# Altium schematic sheet ESP32.SchDoc
size 420 x 297 mm; SheetNumber: 3; SheetTotal: 6
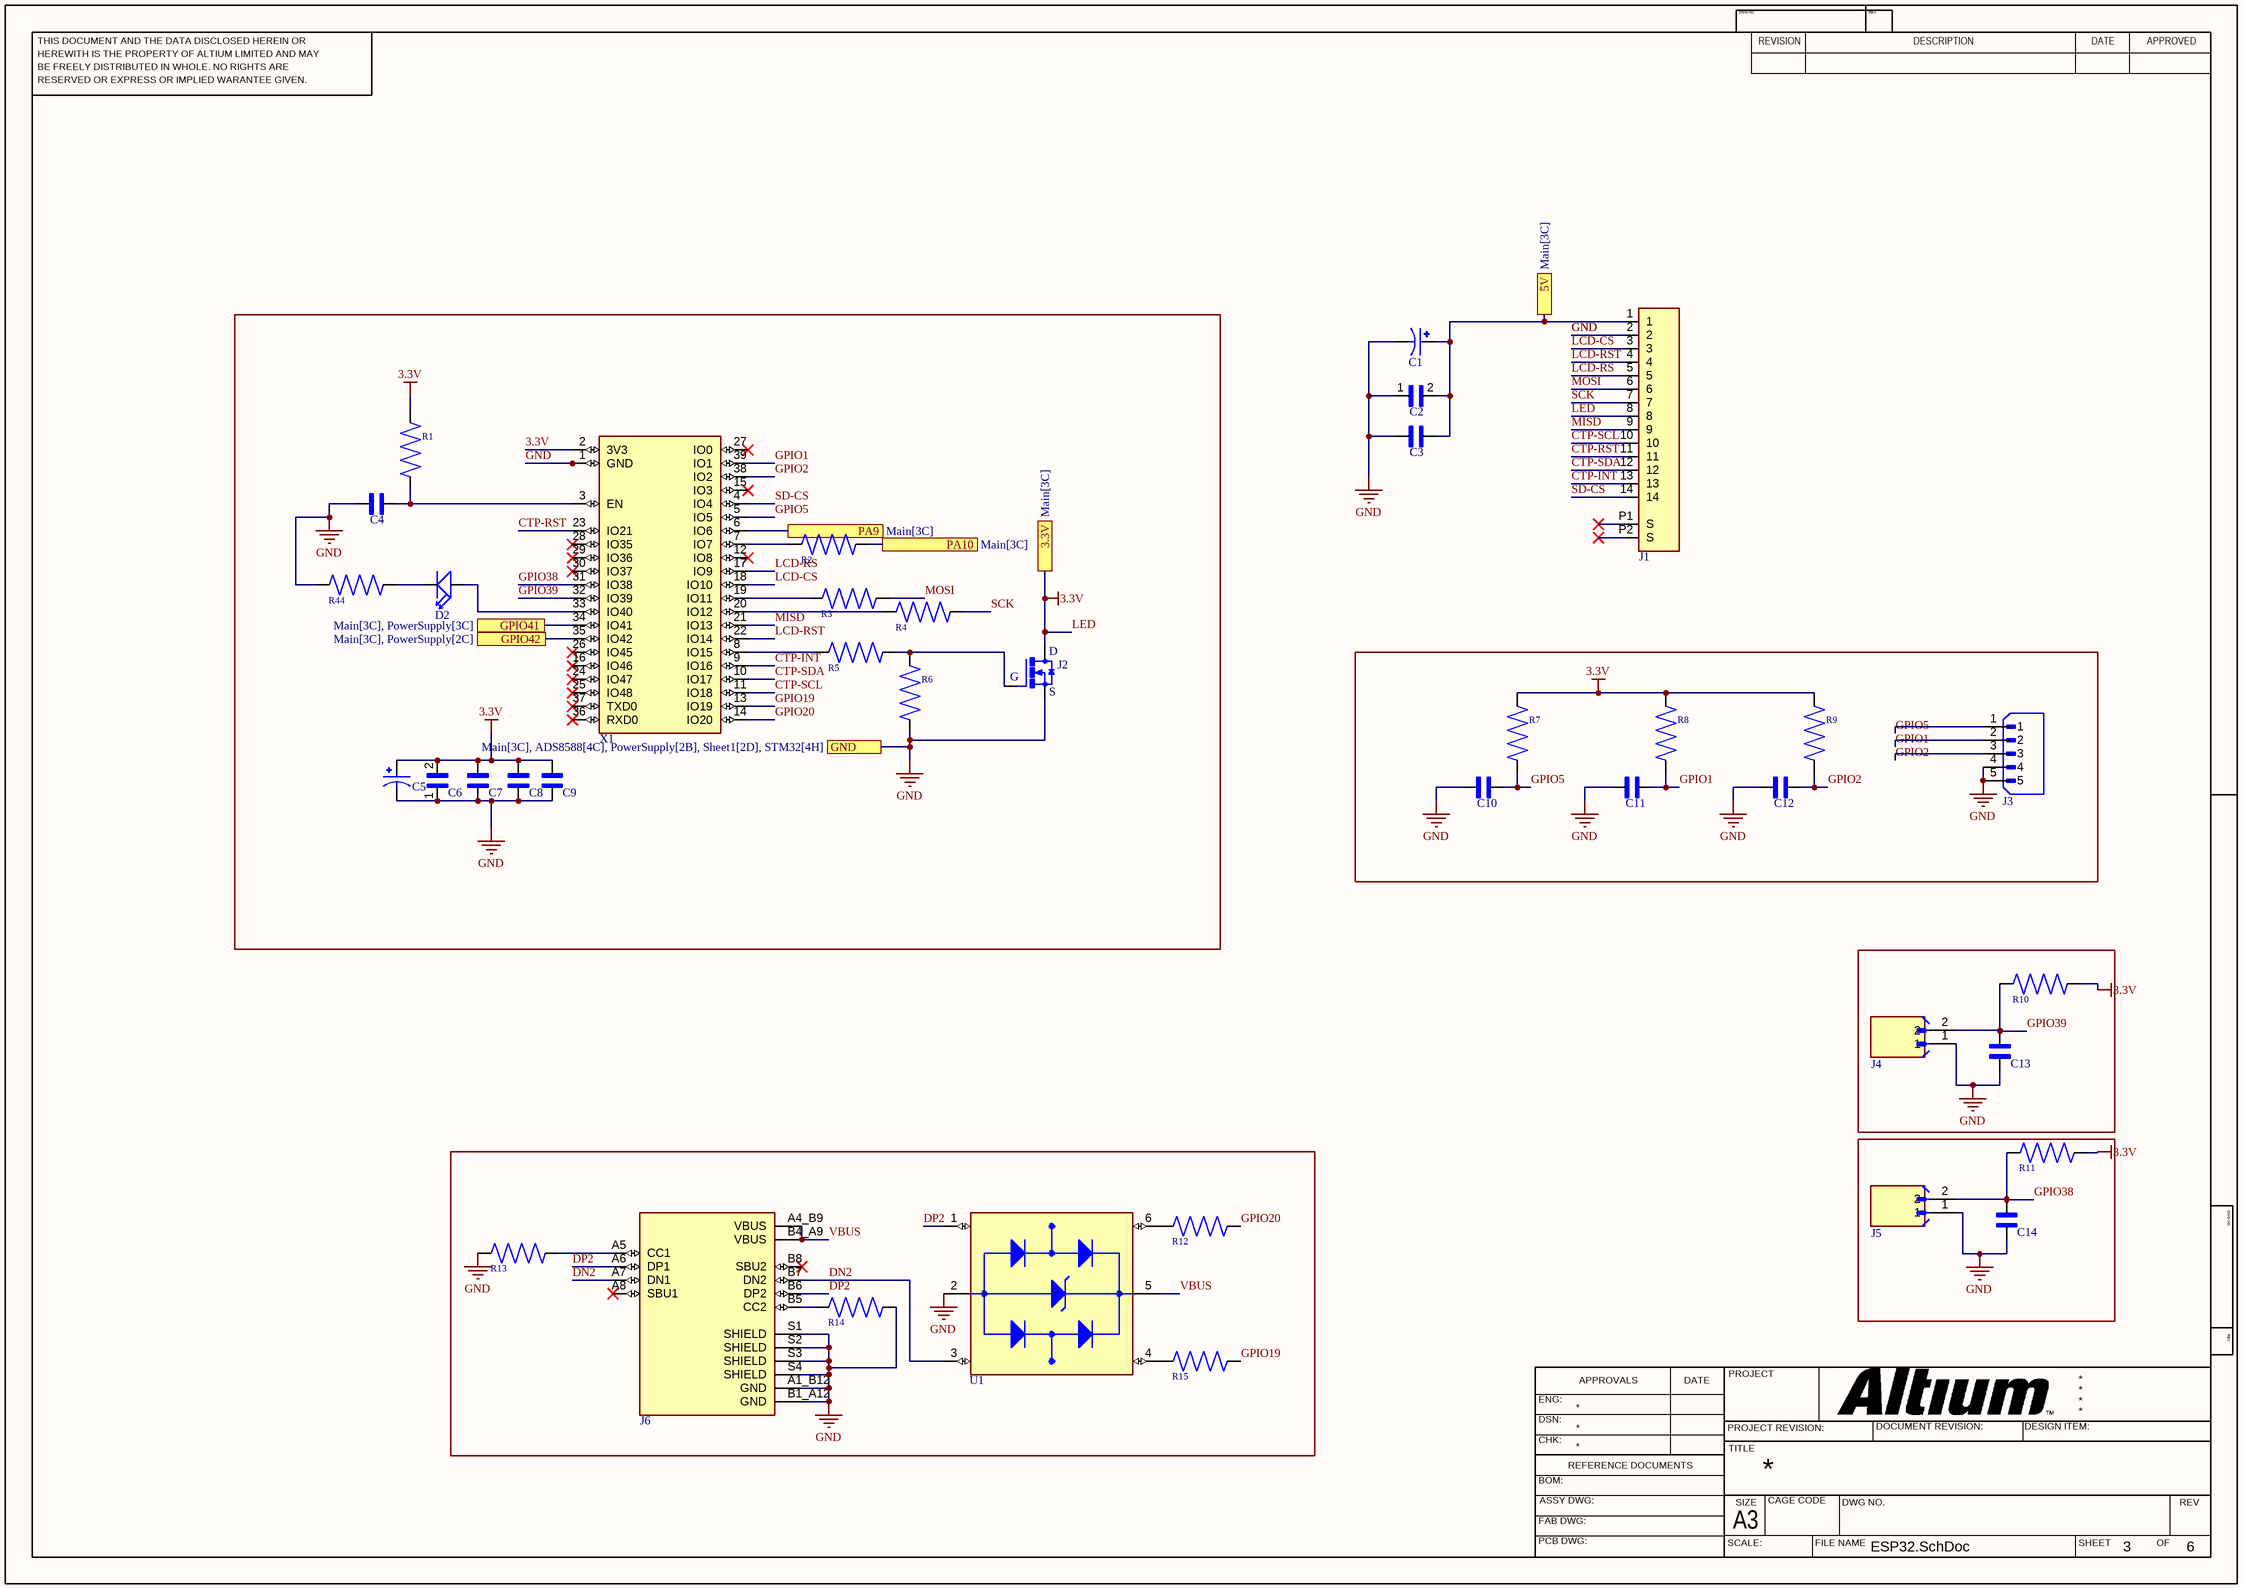
[diagram p0: ESP32.SchDoc]

## Parts
C1  100 uF  [100 uF]  (value not drawn)
C2  C2012X7R1H104K085AA  [CAPC2012X100N]  (value not drawn)
C3  CAP603  [CAP603]  (value not drawn)
C4  CAP603  [CAP603]  (value not drawn)
C5  100 uF  [100 uF]  (value not drawn)
C6  C2012X7R1H104K085AA  [CAPC2012X100N]  (value not drawn)
C7  CAP603  [CAP603]  (value not drawn)
C8  CAP603  [CAP603]  (value not drawn)
C9  CAP603  [CAP603]  (value not drawn)
C10  CAP603  [CAP603]  (value not drawn)
C11  CAP603  [CAP603]  (value not drawn)
C12  CAP603  [CAP603]  (value not drawn)
C13  CAP603  [CAP603]  (value not drawn)
C14  CAP603  [CAP603]  (value not drawn)
D2  SMD-LED-YELLOW-WHITE(0603)  [LED-0603]  (value not drawn)
J1  FPC-connector  [FPC-connector]  (value not drawn)
J2  AO3400  [AO3400]  (value not drawn)
J3  5-pin jst  [5-pin jst]  (value not drawn)
J4  2-pin jst  [2-pin jst]  (value not drawn)
J5  2-pin jst  [2-pin jst]  (value not drawn)
J6  TYPE-C-31-M-12  [TYPE-C-31-M-12]  (value not drawn)
R1  RES-603  [CAP603]  (value not drawn)
R2  RES-603  [CAP603]  (value not drawn)
R3  RES-603  [CAP603]  (value not drawn)
R4  RES-603  [CAP603]  (value not drawn)
R5  RES-603  [CAP603]  (value not drawn)
R6  RES-603  [CAP603]  (value not drawn)
R7  RES-603  [CAP603]  (value not drawn)
R8  RES-603  [CAP603]  (value not drawn)
R9  RES-603  [CAP603]  (value not drawn)
R10  RES-603  [CAP603]  (value not drawn)
R11  RES-603  [CAP603]  (value not drawn)
R12  RES-603  [CAP603]  (value not drawn)
R13  RES-603  [CAP603]  (value not drawn)
R14  RES-603  [CAP603]  (value not drawn)
R15  RES-603  [CAP603]  (value not drawn)
R44  RES-603  [CAP603]  (value not drawn)
U1  USBLC6-2SC6  [USBLC6-2SC6]  (value not drawn)
X1  ESP32-S3-WROOM-1-N16R8  [ESP32S3WROOM1N8R2]  (value not drawn)

## Ports
3.3V (see Main[3C]), 5V (see Main[3C]), GND (see Main[3C], ADS8588[4C], PowerSupply[2B], Sheet1[2D], STM32[4H]), GPIO41 (see Main[3C], PowerSupply[3C]), GPIO42 (see Main[3C], PowerSupply[2C]), PA9 (see Main[3C]), PA10 (see Main[3C])

## Nets
3.3V: C5.1 C6.2 C7.2 C8.2 C9.2 J1.8 J2.3(D) R1.2 R7.2 R8.2 R9.2 R10.1 R11.1 X1.2(3V3) ; port 3.3V  [also labelled LED]
GND: C1.2 C2.1 C3.2 C4.2 C5.2 C6.1 C7.1 C8.1 C9.1 C10.2 C11.2 C12.2 C13.1 C14.1 J1.2 J2.2(S) J3.4 J3.5 J4.1 J5.1 J6.A1_B12(GND) J6.B1_A12(GND) J6.S1(SHIELD) J6.S2(SHIELD) J6.S3(SHIELD) J6.S4(SHIELD) R6.1 R13.2 R14.1 R44.1 U1.2(GND) X1.1(GND) X1.40(GND) X1.41(GND) X1.42(GND) X1.43(GND) X1.44(GND) X1.45(GND) X1.46(GND) X1.47(GND) X1.48(GND) X1.49(GND) ; port GND
5V: C1.1 C2.2 C3.1 J1.1 ; port 5V
CTP-INT: J1.13 X1.9(IO16)
CTP-RST: J1.11 X1.23(IO21)
CTP-SCL: J1.10 X1.11(IO18)
CTP-SDA: J1.12 X1.10(IO17)
DN2: J6.A7(DN1) J6.B7(DN2) U1.3(I/O2_IN)
DP2: J6.A6(DP1) J6.B6(DP2) U1.1(I/O1_IN)
GPIO1: C11.1 J3.2 R8.1 X1.39(IO1)
GPIO2: C12.1 J3.3 R9.1 X1.38(IO2)
GPIO5: C10.1 J3.1 R7.1 X1.5(IO5)
GPIO19: R15.1 X1.13(IO19)
GPIO20: R12.1 X1.14(IO20)
GPIO38: C14.2 J5.2 R11.2 X1.31(IO38)
GPIO39: C13.2 J4.2 R10.2 X1.32(IO39)
GPIO41: X1.34(IO41) ; port GPIO41
GPIO42: X1.35(IO42) ; port GPIO42
LCD-CS: J1.3 X1.18(IO10)
LCD-RS: J1.5 X1.17(IO9)
LCD-RST: J1.4 X1.22(IO14)
MISD: J1.9 X1.21(IO13)
MOSI: J1.6 R3.1
PA9: X1.6(IO6) ; port PA9
PA10: R2.1 ; port PA10
SCK: J1.7 R4.1
SD-CS: J1.14 X1.4(IO4)
VBUS: J6.A4_B9(VBUS) J6.B4_A9(VBUS) U1.5(VBUS)
NetC4_1: C4.1 R1.1 X1.3(EN)
NetD2_NEG: D2.NEG R44.2
NetD2_POS: D2.POS X1.33(IO40)
NetJ2_1: J2.1(G) R5.1 R6.2
NetJ6_A5: J6.A5(CC1) R13.1
NetJ6_B5: J6.B5(CC2) R14.2
NetR2_2: R2.2 X1.7(IO7)
NetR3_2: R3.2 X1.19(IO11)
NetR4_2: R4.2 X1.20(IO12)
NetR5_2: R5.2 X1.8(IO15)
NetR12_2: R12.2 U1.6(I/O1_OUT)
NetR15_2: R15.2 U1.4(I/O2_OUT)

Not connected (* = marked no-connect by the designer): J1 P1(S)* P2(S)*; J6 A8(SBU1)* B8(SBU2)*; X1 12(IO8)* 15(IO3)* 16(IO46)* 24(IO47)* 25(IO48)* 26(IO45)* 27(IO0)* 28(IO35)* 29(IO36)* 30(IO37)* 36(RXD0)* 37(TXD0)*

## Notes on the sheet
- THIS DOCUMENT AND THE DATA DISCLOSED HEREIN OR
- HEREWITH IS THE PROPERTY OF ALTIUM LIMITED AND MAY
- DWG NO:
- REVISION
- REV:
- DESCRIPTION
- DATE
- APPROVED
- BE FREELY DISTRIBUTED IN WHOLE. NO RIGHTS ARE
- RESERVED OR EXPRESS OR IMPLIED WARANTEE GIVEN.
- ENG:
- APPROVALS
- PROJECT
- DSN:
- CHK:
- REFERENCE DOCUMENTS
- PROJECT REVISION:
- TITLE
- DOCUMENT REVISION:
- DESIGN ITEM:
- BOM:
- FAB DWG:
- PCB DWG:
- ASSY DWG:
- SCALE:
- A3
- SIZE
- CAGE CODE
- FILE NAME
- DWG NO.
- SHEET
- OF
- REV

## Library data of the parts
C1 C5 = 100 uF: Capacitor, Polymer Aluminum, Radial, 12mOhm, 100 CAP, 16V, SVPG, Surface Mount | Panasonic Electronic Components 16SVPG100M; SnapEDA_Link: https://www.snapeda.com/parts/16SVPG100M/Panasonic/view-part/?ref=snap; Package: None; Value: *; MF: Panasonic; MP: 16SVPG100M; Check_prices: https://www.snapeda.com/parts/16SVPG100M/Panasonic/view-part/?ref=eda
C2 C6 = C2012X7R1H104K085AA: 0.1 ÂµF Â±10% 50V Ceramic Capacitor X7R 0805 (2012 Metric); MF: TDK; Purchase-URL: https://pricing.snapeda.com/search/part/C2012X7R1H104K085AA/?ref=eda; Package: 2012 TDK; MP: C2012X7R1H104K085AA; Value: *; SnapEDA_Link: https://www.snapeda.com/parts/C2012X7R1H104K085AA/TDK/view-part/?ref=snap; Digi-Key_Part_Number: 445-7534-1-ND; Check_prices: https://www.snapeda.com/parts/C2012X7R1H104K085AA/TDK/view-part/?ref=eda
C3 C4 C7-C14 = CAP603: 0.1 ÂµF Â±5% 10V Ceramic Capacitor X7R 0603 (1608 Metric); MF: Vishay; MP: VJ0603Y104JXQCW1BC; SnapEDA_Link: https://www.snapeda.com/parts/VJ0603Y104JXQCW1BC/Vishay/view-part/?ref=snap; Package: 0603-2 VISHAY; Value: *; Check_prices: https://www.snapeda.com/parts/VJ0603Y104JXQCW1BC/Vishay/view-part/?ref=eda
D2 = SMD-LED-YELLOW-WHITE(0603): SMD LED Yellow-White; MF: Chengguangxing; MP: ADL-0603W; SnapEDA_Link: https://www.snapeda.com/parts/ADL-0603W/Chengguangxing/view-part/106378/?ref=snap; Availability: Unavailable; Value: *; Price: None; Package: None
J1 = FPC-connector: 14 Position FPC Connector Contacts, Top 0.020 (0.50mm) Surface Mount, Right Angle; MF: TE Connectivity; MP: 1-1734839-4; SnapEDA_Link: https://www.snapeda.com/parts/1-1734839-4/TE+Connectivity+AMP+Connectors/view-part/?ref=snap; Package: None; Value: *; EU_RoHS_Compliance: Compliant; Check_prices: https://www.snapeda.com/parts/1-1734839-4/TE+Connectivity+AMP+Connectors/view-part/?ref=eda
J2 = AO3400: N-Channel 30 V 5.8A (Ta) 1.4W (Ta) Surface Mount SOT-23-3; MF: Alpha &; SnapEDA_Link: https://www.snapeda.com/parts/AO3400/Alpha/view-part/?ref=snap; Package: SOT-23-3 Alpha &amp; Omega Semiconductor; MP: AO3400; Check_prices: https://www.snapeda.com/parts/AO3400/Alpha/view-part/?ref=eda; Value: *
J3 = 5-pin jst: Connector Header Through Hole 5 position 0.098 (2.50mm); MF: JST Sales America Inc.; MP: B5B-XH-A(LF)(SN); SnapEDA_Link: https://www.snapeda.com/parts/B5B-XH-A(LF)(SN)/JST+Sales+America+Inc./view-part/?ref=snap; Package: None; Value: *; Check_prices: https://www.snapeda.com/parts/B5B-XH-A(LF)(SN)/JST+Sales+America+Inc./view-part/?ref=eda
J4 J5 = 2-pin jst: Connector Header Through Hole 2 position 0.079 (2.00mm); MF: JST Sales America Inc.; MP: B2B-PH-K-S; SnapEDA_Link: https://www.snapeda.com/parts/B2B-PH-K-S/JST/view-part/?ref=snap; Package: None; Value: *; Check_prices: https://www.snapeda.com/parts/B2B-PH-K-S/JST/view-part/?ref=eda
J6 = TYPE-C-31-M-12: USB Connectors 24 Receptacle 1 8.94*7.3mm RoHS; MF: HRO Electronics Co., Ltd.; SnapEDA_Link: https://www.snapeda.com/parts/TYPE-C-31-M-12/HRO+Electronics+Co.%252C+Ltd./view-part/?ref=snap; Package: Package; Value: *; MP: TYPE-C-31-M-12; Check_prices: https://www.snapeda.com/parts/TYPE-C-31-M-12/HRO+Electronics+Co.%252C+Ltd./view-part/?ref=eda
R1-R15 R44 = RES-603: MF: Yageo; MP: RC0805FR-0710KL; Value: *; SnapEDA_Link: https://www.snapeda.com/parts/RC0805FR-0710KL/Yageo/view-part/?ref=snap; Purchase-URL: https://pricing.snapeda.com/search/part/RC0805FR-0710KL/?ref=eda; Availability: In Stock; Price: None; Package: 2012 Rohm Semiconductor; Check_prices: https://www.snapeda.com/parts/RC0805FR-0710KL/Yageo/view-part/?ref=eda
U1 = USBLC6-2SC6: 17V Clamp 5A (8/20Âµs) Ipp Tvs Diode Surface Mount SOT-23-6; MF: STMicroelectronics; Value: *; SnapEDA_Link: https://www.snapeda.com/parts/USBLC6-2SC6/STMicroelectronics/view-part/?ref=snap; Check_prices: https://www.snapeda.com/parts/USBLC6-2SC6/STMicroelectronics/view-part/?ref=eda; Purchase-URL: https://pricing.snapeda.com/search/part/USBLC6-2SC6/?ref=eda; Price: None; Availability: In Stock; Package: SOT-23-6 STMicroelectronics; MP: USBLC6-2SC6
X1 = ESP32-S3-WROOM-1-N16R8: Bluetooth, WiFi 802.11b/g/n, Bluetooth v5.0 Transceiver Module 2.4GHz PCB Trace Surface Mount; MF: Espressif Systems; SnapEDA_Link: https://www.snapeda.com/parts/ESP32-S3-WROOM-1-N16R8/Espressif+Systems/view-part/?ref=snap; Package: NON STANDARD Espressif Systems; Value: *; MP: ESP32-S3-WROOM-1-N16R8; Check_prices: https://www.snapeda.com/parts/ESP32-S3-WROOM-1-N16R8/Espressif+Systems/view-part/?ref=eda